# Altium schematic sheet MiniScope.SchDoc: MiniScope
size 330 x 241 mm; Author: MContour; DrawnBy: MContour; DocumentNumber: 1; Revision: V3.0
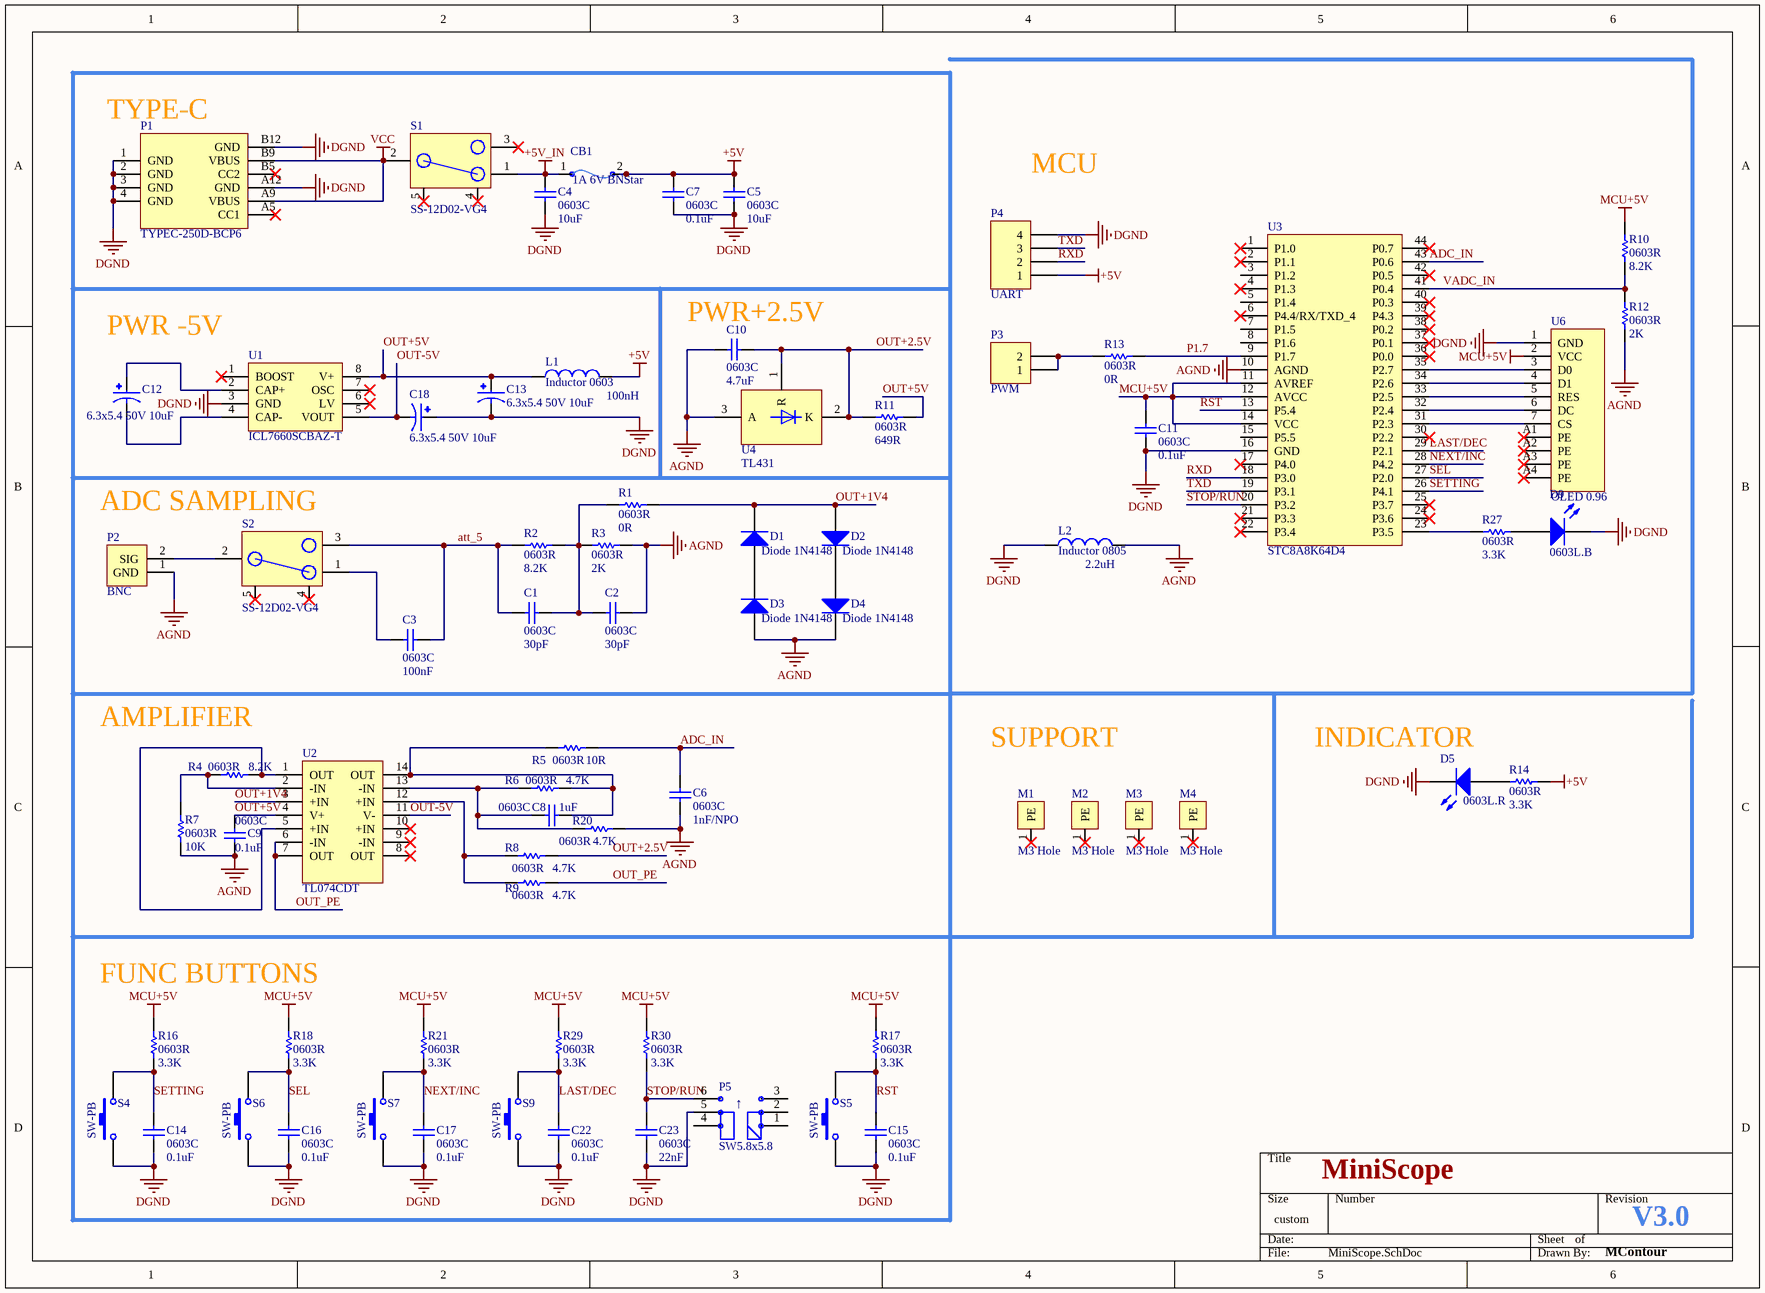
[diagram p0: MiniScope.SchDoc]

## Parts
C1  0603C  value 30pF  [0603C]
C2  0603C  value 30pF  [0603C]
C3  0603C  value 100nF  [0603C]
C4  0603C  value 10uF  [0603C]
C5  0603C  value 10uF  [0603C]
C6  0603C  value 1nF/NPO  [0603C]
C7  0603C  value 0.1uF  [0603C]
C8  0603C  value 1uF  [0603C]
C9  0603C  value 0.1uF  [0603C]
C10  0603C  value 4.7uF  [0603C]
C11  0603C  value 0.1uF  [0603C]
C12  6.3x5.4 50V 10uF  [CAP 6.3x5.4]
C13  6.3x5.4 50V 10uF  [CAP 6.3x5.4]
C14  0603C  value 0.1uF  [0603C]
C15  0603C  value 0.1uF  [0603C]
C16  0603C  value 0.1uF  [0603C]
C17  0603C  value 0.1uF  [0603C]
C18  6.3x5.4 50V 10uF  [CAP 6.3x5.4]
C22  0603C  value 0.1uF  [0603C]
C23  0603C  value 22nF  [0603C]
CB1  1A 6V BNStar  [SMD0603]
D1  Diode 1N4148  [1N4148W]
D2  Diode 1N4148  [1N4148W]
D3  Diode 1N4148  [1N4148W]
D4  Diode 1N4148  [1N4148W]
D5  0603L.R  [LED 0603]
D9  0603L.B  [LED 0603]
L1  Inductor 0603  value 100nH  [IND_0603]
L2  Inductor 0805  value 2.2uH  [IND_0805]
M1  M3 Hole  [M3 Hole]
M2  M3 Hole  [M3 Hole]
M3  M3 Hole  [M3 Hole]
M4  M3 Hole  [M3 Hole]
P1  TYPEC-250D-BCP6  [TYPEC-250D-BCP6]
P2  BNC  [BNC]
P3  PWM  [HEADER-1X2]
P4  UART  [HEADER-1X4]
P5  SW5.8x5.8  [SW5.8x5.8 SL]
R1  0603R  value 0R  [0603R]
R2  0603R  value 8.2K  [0603R]
R3  0603R  value 2K  [0603R]
R4  0603R  value 8.2K  [0603R]
R5  0603R  value 10R  [0603R]
R6  0603R  value 4.7K  [0603R]
R7  0603R  value 10K  [0603R]
R8  0603R  value 4.7K  [0603R]
R9  0603R  value 4.7K  [0603R]
R10  0603R  value 8.2K  [0603R]
R11  0603R  [0603R]
R12  0603R  value 2K  [0603R]
R13  0603R  value 0R  [0603R]
R14  0603R  value 3.3K  [0603R]
R16  0603R  value 3.3K  [0603R]
R17  0603R  value 3.3K  [0603R]
R18  0603R  value 3.3K  [0603R]
R20  0603R  value 4.7K  [0603R]
R21  0603R  value 3.3K  [0603R]
R27  0603R  value 3.3K  [0603R]
R29  0603R  value 3.3K  [0603R]
R30  0603R  value 3.3K  [0603R]
S1  SS-12D02-VG4  [SS-12D02-VG4]
S2  SS-12D02-VG4  [SS-12D02-VG4]
S4  SW-PB  [SW_3.6×6.1x2.5_smd]
S5  SW-PB  [SW_3.6×6.1x2.5_smd]
S6  SW-PB  [SW_3.6×6.1x2.5_smd]
S7  SW-PB  [SW_3.6×6.1x2.5_smd]
S9  SW-PB  [SW_3.6×6.1x2.5_smd]
U1  ICL7660SCBAZ-T  [ICL7660SCBAZ-T]
U2  TL074CDT  [TL074CDT]
U3  STC8A8K64D4  [STC8A8K64D4]
U4  TL431  [TL431]
U6  OLED 0.96  [OLED 0.96ch]

## Nets
+5V: C5.2 C7.2 CB1.2(PE) L1.2 P4.1 R14.1
+5V_IN: C4.2 CB1.1(PE) S1.1
AGND: C2.2 C6.2 C9.2 C10.2 D3.1(A) D4.2(K) L2.2 P2.1(GND) R3.1 R7.2 R12.2 R20.2 U3.10(AGND) U4.3(A)
DGND: C4.1 C5.1 C7.1 C11.2 C13.2 C14.2 C15.2 C16.2 C17.2 C18.1 C22.2 C23.2 D5.2(K) D9.2(K) L2.1 P1.1(GND) P1.2(GND) P1.3(GND) P1.4(GND) P1.A12(GND) P1.B12(GND) P4.4 P5.5 S4.1 S5.1 S6.1 S7.1 S9.1 U1.3(GND) U3.16(GND) U6.1(GND)
MCU+5V: C11.1 R10.1 R16.2 R17.2 R18.2 R21.2 R29.2 R30.2 U3.11(AVREF) U3.12(AVCC) U3.14(VCC) U6.2(VCC)
VCC: P1.A9(VBUS) P1.B9(VBUS) S1.2
ADC_IN: C6.1 R5.2 U3.43(P0.6)
att_5: C1.1 C3.2 R2.2 S2.3
LAST/DEC: C22.1 R29.1 S9.2 U3.29(P2.1)
NEXT/INC: C17.1 R21.1 S7.2 U3.28(P4.2)
OUT+1V4: D1.2(K) D2.1(A) R1.1 U2.3(+IN)
OUT+2.5V: C10.1 R8.2 R11.1 U4.1(R) U4.2(K)
OUT+5V: C9.1 C13.1 L1.1 R11.2 U1.8(V+) U2.4(V+)
OUT-5V: C18.2 U1.5(VOUT) U2.11(V-)
OUT_PE: R9.2 U2.6(-IN) U2.7(OUT)
P1.7: R13.1 U3.9(P1.7)
RST: C15.1 R17.1 S5.2 U3.13(P5.4)
RXD: P4.2 U3.18(P3.0)
SEL: C16.1 R18.1 S6.2 U3.27(P2.0)
SETTING: C14.1 R16.1 S4.2 U3.26(P4.1)
STOP/RUN: C23.1 P5.6 R30.1 U3.20(P3.2)
TXD: P4.3 U3.19(P3.1)
VADC_IN: R10.2 R12.1 U3.41(P0.4)
NetC1_2: C1.2 C2.1 R1.2 R2.1 R3.2
NetC3_1: C3.1 S2.1
NetC8_1: C8.1 R6.1 R20.1 U2.13(-IN)
NetC8_2: C8.2 R5.1 R6.2 U2.14(OUT)
NetC12_1: C12.1 U1.2(CAP+)
NetC12_2: C12.2 U1.4(CAP-)
NetD1_1: D1.1(A) D3.2(K)
NetD2_2: D2.2(K) D4.1(A)
NetD5_1: D5.1(A) R14.2
NetD9_1: D9.1(A) R27.2
NetP2_2: P2.2(SIG) S2.2
NetP3_1: P3.1 P3.2 R13.2
NetR4_1: R4.1 U2.1(OUT) U2.5(+IN)
NetR4_2: R4.2 R7.1 U2.2(-IN)
NetR8_1: R8.1 R9.1 U2.12(+IN)
NetR27_1: R27.1 U3.23(P3.5)
NetU3_31: U3.31(P2.3) U6.7(CS)
NetU3_32: U3.32(P2.4) U6.6(DC)
NetU3_33: U3.33(P2.5) U6.5(RES)
NetU3_34: U3.34(P2.6) U6.4(D1)
NetU3_35: U3.35(P2.7) U6.3(D0)

Not connected (* = marked no-connect by the designer): M1 1(PE)*; M2 1(PE)*; M3 1(PE)*; M4 1(PE)*; P1 A5(CC1)* B5(CC2)*; P5 1(EP) 2(EP) 3(EP) 4; S1 3(75)* 4(73)* 5(72)*; S2 4(73)* 5(72)*; U1 1(BOOST)* 6(LV)* 7(OSC)*; U2 8(OUT)* 9(-IN)* 10(+IN)*; U3 1(P1.0)* 2(P1.1)* 3(P1.2) 4(P1.3)* 5(P1.4) 6(P4.4/RX/TXD_4)* 7(P1.5) 8(P1.6) 15(P5.5) 17(P4.0)* 21(P3.3)* 22(P3.4)* 24(P3.6)* 25(P3.7)* 30(P2.2)* 36(P0.0)* 37(P0.1)* 38(P0.2)* 39(P4.3)* 40(P0.3)* 42(P0.5)* 44(P0.7)*; U6 A1(PE)* A2(PE)* A3(PE)* A4(PE)*

## Notes on the sheet
- (near P1) TYPE-C
- MCU
- PWR -5V
- (near C10) PWR+2.5V
- ADC SAMPLING
- (near R4) AMPLIFIER
- SUPPORT
- (near D5) INDICATOR
- FUNC BUTTONS
- (in symbol Res1) 649R
- (in symbol SW5.8x5.8) →

## Library data of the parts
C1-C11 C14-C17 C22 C23 = Cap: Capacitor; Published: 8-Jun-2000; LatestRevisionDate: 17-Jul-2002; LatestRevisionNote: Re-released for DXP Platform.; PackageReference: RAD-0.3; Publisher: Altium Limited; PackageDescription: Radial Cap, Thru-Hole; 2 Leads; 0.3 in Pin Spacing
C12 C13 C18 = 6.3x5.4 50V 10uF: Cap Aluminum Lytic 10uF 50V 20% (6.3 X 5.4mm) SMD; MF: Panasonic; MP: EEE-1AA330NP; Package: RADIAL-2 Panasonic; Value: *; Purchase-URL: https://pricing.snapeda.com/search/part/EEE-1AA330NP/?ref=eda; Availability: In Stock; SnapEDA_Link: https://www.snapeda.com/parts/EEE-1AA330NP/Panasonic/view-part/?ref=snap; Price: None; Check_prices: https://www.snapeda.com/parts/EEE-1AA330NP/Panasonic/view-part/?ref=eda
CB1 = CircuitBreaker
D1-D4 = Diode 1N4148: High Conductance Fast Diode; Published: 8-Jun-2000; LatestRevisionDate: 17-Jul-2002; LatestRevisionNote: Re-released for DXP Platform.; DatasheetVersion: 1997; PackageReference: DO-35; Publisher: Altium Limited; PackageDescription: Diode, Axial; Body 3.8 x 1.9 mm (LxDia. max), Lead Dia. 0.53 mm (max); Code_JEDEC: DO-204-AH; ComponentLink1Description: Manufacturer Link; ComponentLink1URL: http://www.fairchildsemi.com/; ComponentLink2Description: Datasheet; ComponentLink2URL: http://www.fairchildsemi.com/ds/1N%2F1N4148.pdf
D5 D9 = LED0: Typical INFRARED GaAs LED; Published: 8-Jun-2000; LatestRevisionDate: 08-Jul-2005; LatestRevisionNote: Mech Layer 1 removed.; PackageReference: LED-0; Publisher: Altium Limited; PackageDescription: LED; 2 Leads
L1 L2 = Inductor: Code_IEC: 1005; Published: 8-Jun-2000; LatestRevisionDate: 29-May-2009; LatestRevisionNote: IPC-7351 Footprint Added.; PackageReference: 0402-A; Publisher: Altium Limited; PackageDescription: Chip Inductor; Code_JEITA: 0402
P3 = Header 2: Header, 2-Pin; LatestRevisionDate: 17-Jul-2002; LatestRevisionNote: Re-released for DXP Platform.; Publisher: Altium Limited
P4 = Header 4: Header, 4-Pin; LatestRevisionDate: 17-Jul-2002; LatestRevisionNote: Re-released for DXP Platform.; Publisher: Altium Limited
R1-R14 R16-R18 R20 R21 R27 R29 R30 = Res1: Resistor; Published: 8-Jun-2000; LatestRevisionDate: 17-Jul-2002; LatestRevisionNote: Re-released for DXP Platform.; PackageReference: AXIAL-0.3; Publisher: Altium Limited; PackageDescription: Axial Device, Thru-Hole; 2 Leads; 0.3 in Pin Spacing
S4-S7 S9 = SW-PB: Switch; Published: 24-Mar-1999; LatestRevisionDate: 17-Jul-2002; LatestRevisionNote: Re-released for DXP Platform.; PackageReference: SPST-2; Publisher: Altium Limited; PackageDescription: Switch; 2 Leads
U3 = STC8A8K64S4A12